# EAGLE schematic untitled (EAGLE 6.4)
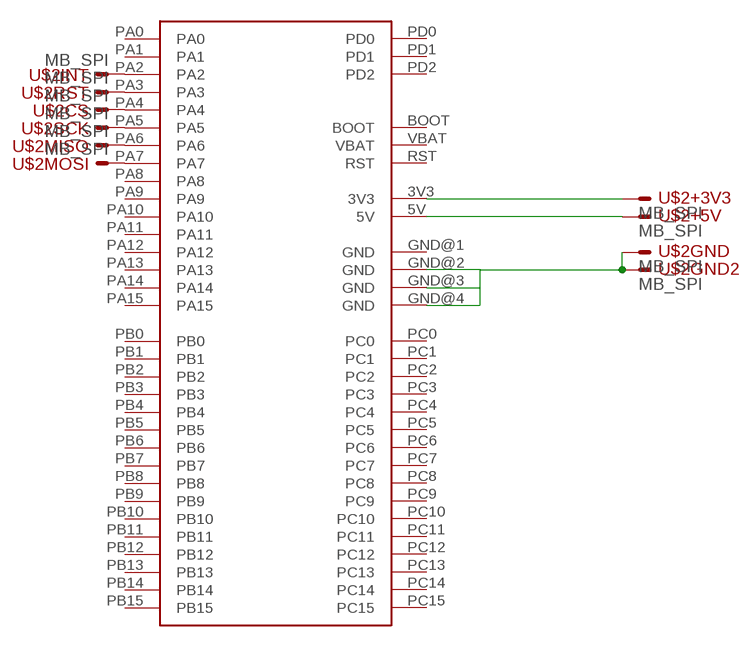
[diagram p0: schematic, sheet 1]

## Parts
U$1  STM32_DISCOVERY  [STM32_DISCOVERY]
U$2  MB_SPI  [MB_SPI]

## Nets
N$1: U$1.GND@2(GND) U$1.GND@3(GND) U$1.GND@4(GND) U$2.GND U$2.GPIOA
N$2: U$1.3V3 U$2.+3.3V
N$3: U$1.5V U$2.+5V
N$4: U$1.PA4 U$2.CS
N$5: U$1.PA5 U$2.SCK
N$6: U$1.PA6 U$2.MISO
N$7: U$1.PA7 U$2.MOSI
N$8: U$1.PA3 U$2.RST
N$9: U$1.PA2 U$2.INT
Unconnected: U$1.BOOT U$1.GND@1(GND) U$1.NC@1(NC) U$1.NC@2(NC) U$1.PA0 U$1.PA1 U$1.PA8 U$1.PA9 U$1.PA10 U$1.PA11 U$1.PA12 U$1.PA13 U$1.PA14 U$1.PA15 U$1.PB0 U$1.PB1 U$1.PB2 U$1.PB3 U$1.PB4 U$1.PB5 U$1.PB6 U$1.PB7 U$1.PB8 U$1.PB9 U$1.PB10 U$1.PB11 U$1.PB12 U$1.PB13 U$1.PB14 U$1.PB15 U$1.PC0 U$1.PC1 U$1.PC2 U$1.PC3 U$1.PC4 U$1.PC5 U$1.PC6 U$1.PC7 U$1.PC8 U$1.PC9 U$1.PC10 U$1.PC11 U$1.PC12 U$1.PC13 U$1.PC14 U$1.PC15 U$1.PD0 U$1.PD1 U$1.PD2 U$1.RST U$1.VBAT

## Library data of the parts
U$1 = stm32_discovery:STM32_DISCOVERY: STM32 Value line discovery
U$2 = lieven:MB_SPI